# EAGLE schematic Keyboard (EAGLE 9.4.2)
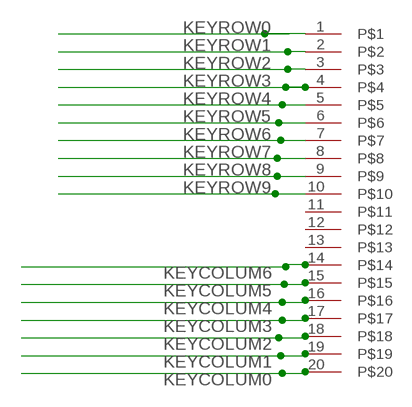
[diagram p0: schematic, sheet 1]

## Parts
U$1  FC1-20-L2-T-WT20PIN  [FC1-20-L2-T-WT]

## Nets
KEYCOLUM0: U$1.20
KEYCOLUM1: U$1.19
KEYCOLUM2: U$1.18
KEYCOLUM3: U$1.17
KEYCOLUM4: U$1.16
KEYCOLUM5: U$1.15
KEYCOLUM6: U$1.14
KEYROW0: U$1.1
KEYROW1: U$1.2
KEYROW2: U$1.3
KEYROW3: U$1.4
KEYROW4: U$1.5
KEYROW5: U$1.6
KEYROW6: U$1.7
KEYROW7: U$1.8
KEYROW8: U$1.9
KEYROW9: U$1.10
Unconnected: U$1.11 U$1.12 U$1.13

## Library data of the parts
U$1 = FPC:FC1-20-L2-T-WT20PIN